# Altium project SCB.PrjPCB (part 3 of 6)

## Sheet CPU_Memory.SchDoc
size A3
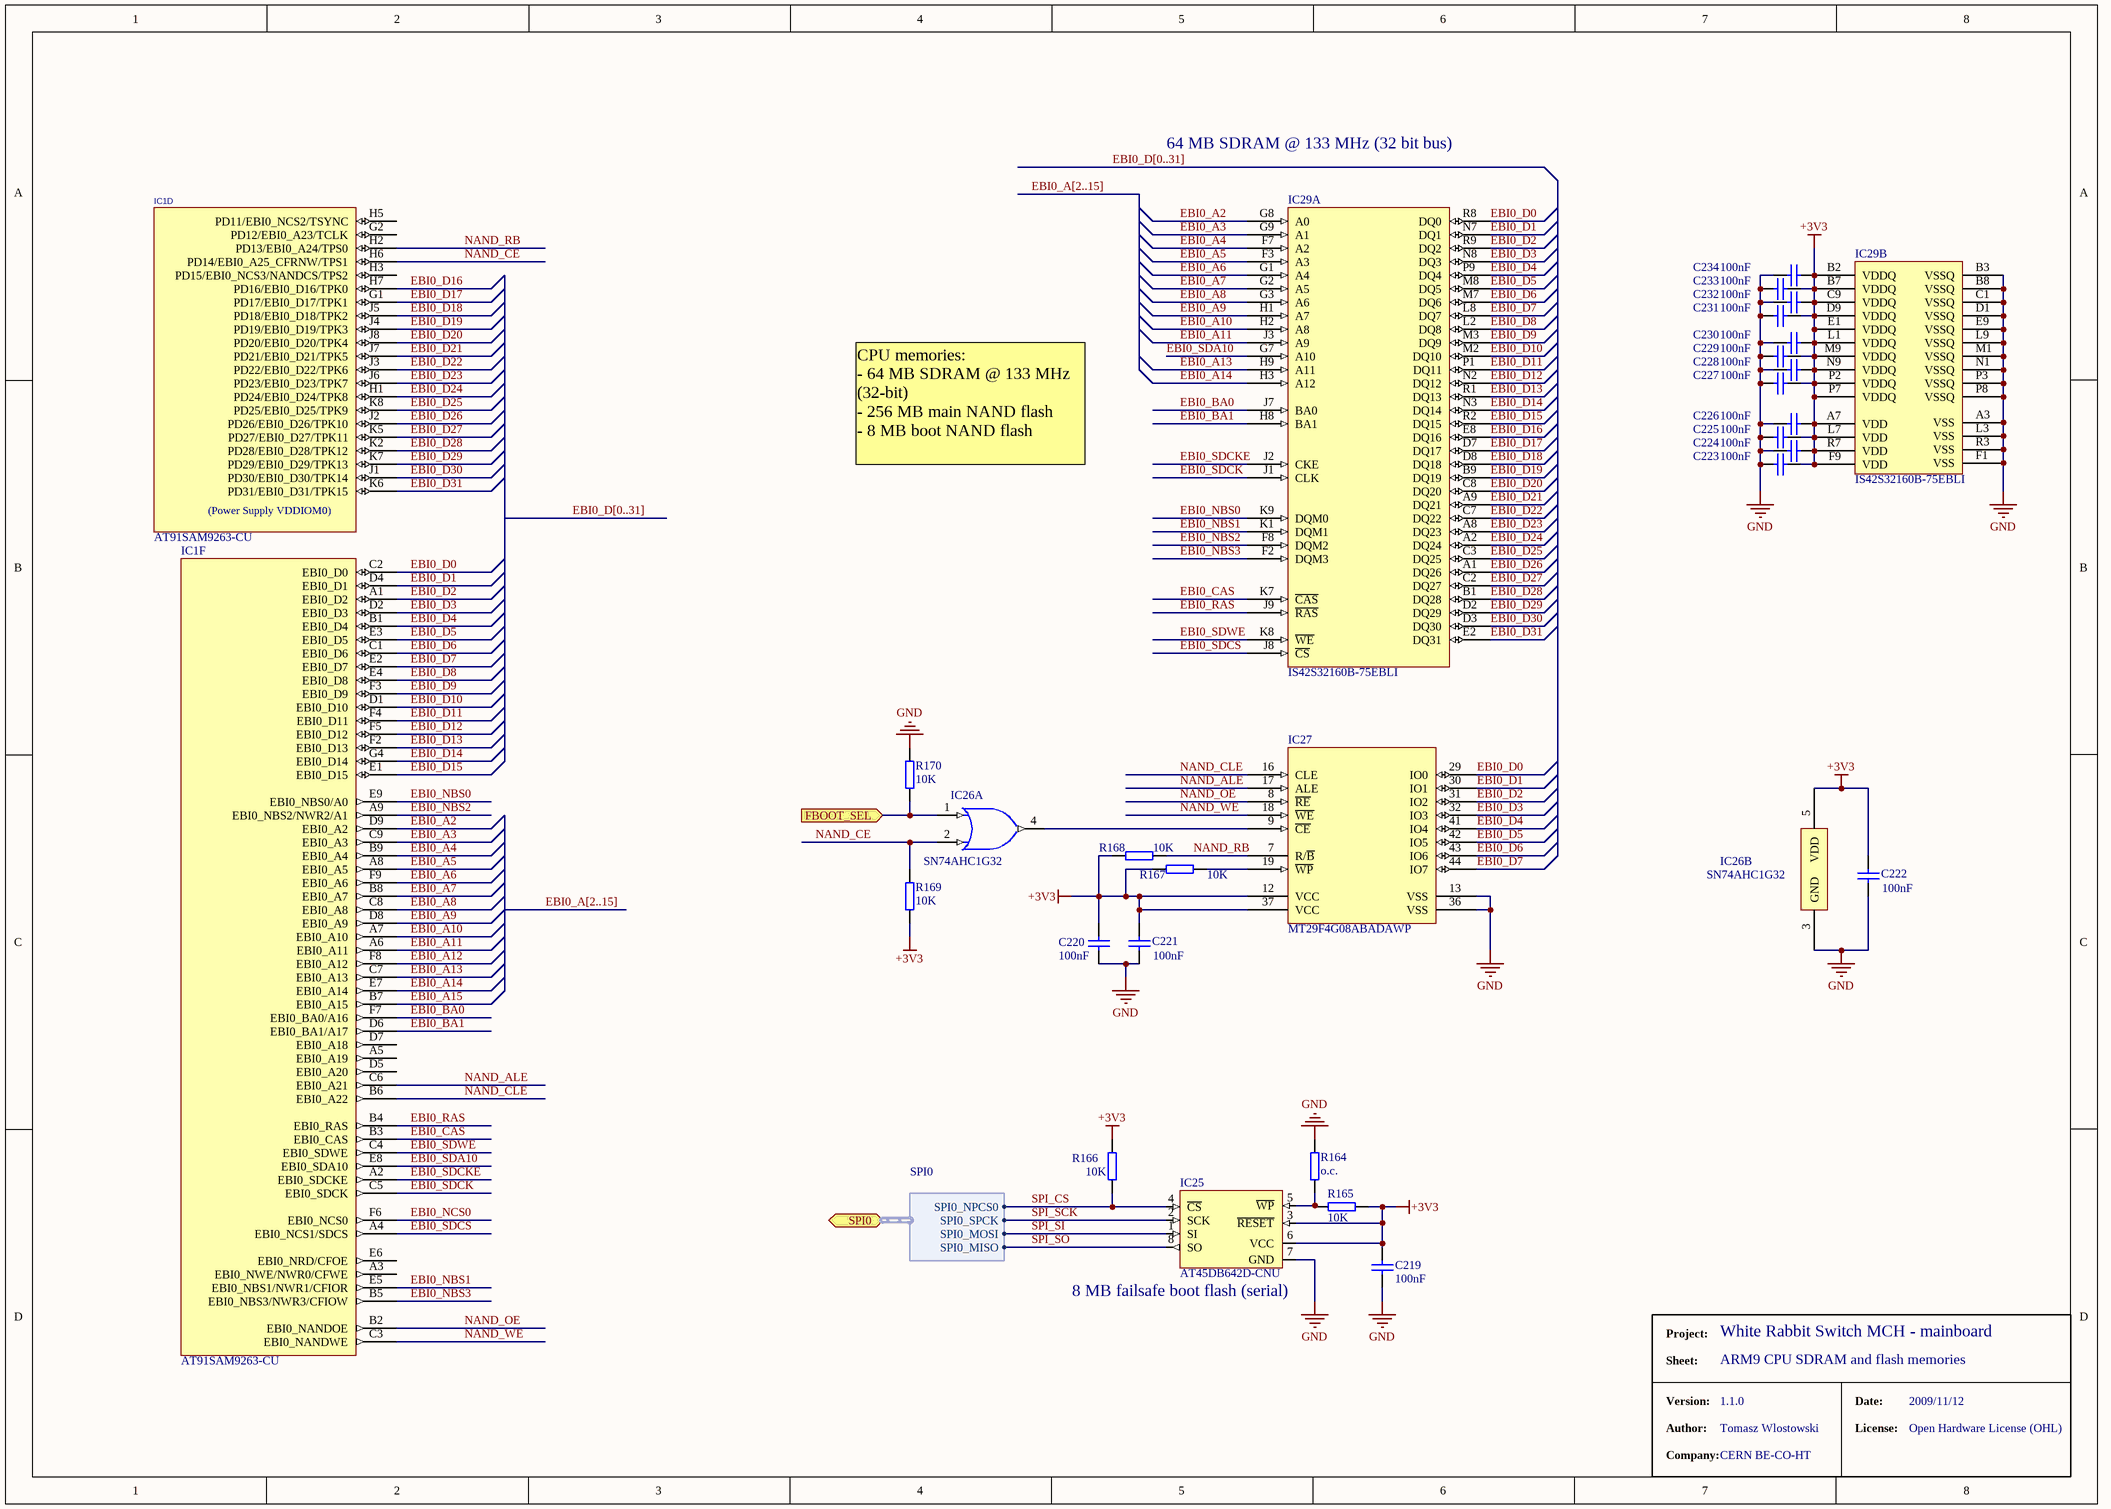
[diagram p8: CPU_Memory.SchDoc]

### Parts
(Parts that share a designator on the sheet are numbered #1, #2 ... from top to bottom, then left to right.)
C219  100nF  [CC1005-0402]
C220  100nF  [CC1005-0402]
C221  100nF  [CC1005-0402]
C222  100nF  [CC1005-0402]
C223  100nF  [CC1005-0402]
C224  100nF  [CC1005-0402]
C225  100nF  [CC1005-0402]
C226  100nF  [CC1005-0402]
C227  100nF  [CC1005-0402]
C228  100nF  [CC1005-0402]
C229  100nF  [CC1005-0402]
C230  100nF  [CC1005-0402]
C231  100nF  [CC1005-0402]
C232  100nF  [CC1005-0402]
C233  100nF  [CC1005-0402]
C234  100nF  [CC1005-0402]
IC1#1  AT91SAM9263-CU  [TFBGA324]  (part D of 12)
IC1#2  AT91SAM9263-CU  [TFBGA324]  (part F of 9)
IC25  AT45DB642D-CNU  [8CN3]
IC26  SN74AHC1G32  [SOT23-5AL]  (parts A,B of 2)
IC27  MT29F4G08ABADAWP  [TSOP48_12x20]
IC29  IS42S32160B-75EBLI  [BGA90C80P9X15_1300X1100X120]  (parts A,B of 2)
R164  o.c.  [0402]
R165  10K  [0402]
R166  10K  [0402]
R167  10K  [0402]
R168  10K  [0402]
R169  10K  [0402]
R170  10K  [0402]

### Ports
FBOOT_SEL (in), SPI0 (harness SPI0)

### Harnesses
SPI0: SPI0_MISO, SPI0_MOSI, SPI0_SPCK, SPI0_NPCS0

### Nets
+3V3: C219.1 C220.2 C221.2 C222.2 C223.1 C224.1 C225.1 C226.1 C227.1 C228.1 C229.1 C230.1 C231.1 C232.1 C233.1 C234.1 IC25.3(~{RESET}) IC25.6(VCC) IC26.5(VDD) IC27.12(VCC) IC27.37(VCC) IC29.A7(VDD) IC29.B2(VDDQ) IC29.B7(VDDQ) IC29.C9(VDDQ) IC29.D9(VDDQ) IC29.E1(VDDQ) IC29.F9(VDD) IC29.L1(VDDQ) IC29.L7(VDD) IC29.M9(VDDQ) IC29.N9(VDDQ) IC29.P2(VDDQ) IC29.P7(VDDQ) IC29.R7(VDD) R165.2 R166.2 R167.2 R168.2 R169.2
GND: C219.2 C220.1 C221.1 C222.1 C223.2 C224.2 C225.2 C226.2 C227.2 C228.2 C229.2 C230.2 C231.2 C232.2 C233.2 C234.2 IC25.7(GND) IC26.3(GND) IC27.13(VSS) IC27.36(VSS) IC29.A3(VSS) IC29.B3(VSSQ) IC29.B8(VSSQ) IC29.C1(VSSQ) IC29.D1(VSSQ) IC29.E9(VSSQ) IC29.F1(VSS) IC29.L3(VSS) IC29.L9(VSSQ) IC29.M1(VSSQ) IC29.N1(VSSQ) IC29.P3(VSSQ) IC29.P8(VSSQ) IC29.R3(VSS) R164.1 R170.2
EBI0_A2: IC1#2.D9(EBI0_A2) IC29.G8(A0)
EBI0_A3: IC1#2.C9(EBI0_A3) IC29.G9(A1)
EBI0_A4: IC1#2.B9(EBI0_A4) IC29.F7(A2)
EBI0_A5: IC1#2.A8(EBI0_A5) IC29.F3(A3)
EBI0_A6: IC1#2.F9(EBI0_A6) IC29.G1(A4)
EBI0_A7: IC1#2.B8(EBI0_A7) IC29.G2(A5)
EBI0_A8: IC1#2.C8(EBI0_A8) IC29.G3(A6)
EBI0_A9: IC1#2.D8(EBI0_A9) IC29.H1(A7)
EBI0_A10: IC1#2.A7(EBI0_A10) IC29.H2(A8)
EBI0_A11: IC1#2.A6(EBI0_A11) IC29.J3(A9)
EBI0_A12: IC1#2.F8(EBI0_A12)
EBI0_A13: IC1#2.C7(EBI0_A13) IC29.H9(A11)
EBI0_A14: IC1#2.E7(EBI0_A14) IC29.H3(A12)
EBI0_A15: IC1#2.B7(EBI0_A15)
EBI0_BA0: IC1#2.F7(EBI0_BA0/A16) IC29.J7(BA0)
EBI0_BA1: IC1#2.D6(EBI0_BA1/A17) IC29.H8(BA1)
EBI0_CAS: IC1#2.B3(EBI0_CAS) IC29.K7(~{CAS})
EBI0_D0: IC1#2.C2(EBI0_D0) IC27.29(IO0) IC29.R8(DQ0)
EBI0_D1: IC1#2.D4(EBI0_D1) IC27.30(IO1) IC29.N7(DQ1)
EBI0_D2: IC1#2.A1(EBI0_D2) IC27.31(IO2) IC29.R9(DQ2)
EBI0_D3: IC1#2.D2(EBI0_D3) IC27.32(IO3) IC29.N8(DQ3)
EBI0_D4: IC1#2.B1(EBI0_D4) IC27.41(IO4) IC29.P9(DQ4)
EBI0_D5: IC1#2.E3(EBI0_D5) IC27.42(IO5) IC29.M8(DQ5)
EBI0_D6: IC1#2.C1(EBI0_D6) IC27.43(IO6) IC29.M7(DQ6)
EBI0_D7: IC1#2.E2(EBI0_D7) IC27.44(IO7) IC29.L8(DQ7)
EBI0_D8: IC1#2.E4(EBI0_D8) IC29.L2(DQ8)
EBI0_D9: IC1#2.F3(EBI0_D9) IC29.M3(DQ9)
EBI0_D10: IC1#2.D1(EBI0_D10) IC29.M2(DQ10)
EBI0_D11: IC1#2.F4(EBI0_D11) IC29.P1(DQ11)
EBI0_D12: IC1#2.F5(EBI0_D12) IC29.N2(DQ12)
EBI0_D13: IC1#2.F2(EBI0_D13) IC29.R1(DQ13)
EBI0_D14: IC1#2.G4(EBI0_D14) IC29.N3(DQ14)
EBI0_D15: IC1#2.E1(EBI0_D15) IC29.R2(DQ15)
EBI0_D16: IC1#1.H7(PD16/EBI0_D16/TPK0) IC29.E8(DQ16)
EBI0_D17: IC1#1.G1(PD17/EBI0_D17/TPK1) IC29.D7(DQ17)
EBI0_D18: IC1#1.J5(PD18/EBI0_D18/TPK2) IC29.D8(DQ18)
EBI0_D19: IC1#1.J4(PD19/EBI0_D19/TPK3) IC29.B9(DQ19)
EBI0_D20: IC1#1.J8(PD20/EBI0_D20/TPK4) IC29.C8(DQ20)
EBI0_D21: IC1#1.J7(PD21/EBI0_D21/TPK5) IC29.A9(DQ21)
EBI0_D22: IC1#1.J3(PD22/EBI0_D22/TPK6) IC29.C7(DQ22)
EBI0_D23: IC1#1.J6(PD23/EBI0_D23/TPK7) IC29.A8(DQ23)
EBI0_D24: IC1#1.H1(PD24/EBI0_D24/TPK8) IC29.A2(DQ24)
EBI0_D25: IC1#1.K8(PD25/EBI0_D25/TPK9) IC29.C3(DQ25)
EBI0_D26: IC1#1.J2(PD26/EBI0_D26/TPK10) IC29.A1(DQ26)
EBI0_D27: IC1#1.K5(PD27/EBI0_D27/TPK11) IC29.C2(DQ27)
EBI0_D28: IC1#1.K2(PD28/EBI0_D28/TPK12) IC29.B1(DQ28)
EBI0_D29: IC1#1.K7(PD29/EBI0_D29/TPK13) IC29.D2(DQ29)
EBI0_D30: IC1#1.J1(PD30/EBI0_D30/TPK14) IC29.D3(DQ30)
EBI0_D31: IC1#1.K6(PD31/EBI0_D31/TPK15) IC29.E2(DQ31)
EBI0_NBS0: IC1#2.E9(EBI0_NBS0/A0) IC29.K9(DQM0)
EBI0_NBS1: IC1#2.E5(EBI0_NBS1/NWR1/CFIOR) IC29.K1(DQM1)
EBI0_NBS2: IC1#2.A9(EBI0_NBS2/NWR2/A1) IC29.F8(DQM2)
EBI0_NBS3: IC1#2.B5(EBI0_NBS3/NWR3/CFIOW) IC29.F2(DQM3)
EBI0_NCS0: IC1#2.F6(EBI0_NCS0)
EBI0_RAS: IC1#2.B4(EBI0_RAS) IC29.J9(~{RAS})
EBI0_SDA10: IC1#2.E8(EBI0_SDA10) IC29.G7(A10)
EBI0_SDCK: IC1#2.C5(EBI0_SDCK) IC29.J1(CLK)
EBI0_SDCKE: IC1#2.A2(EBI0_SDCKE) IC29.J2(CKE)
EBI0_SDCS: IC1#2.A4(EBI0_NCS1/SDCS) IC29.J8(~{CS})
EBI0_SDWE: IC1#2.C4(EBI0_SDWE) IC29.K8(~{WE})
NAND_ALE: IC1#2.C6(EBI0_A21) IC27.17(ALE)
NAND_CE: IC1#1.H6(PD14/EBI0_A25_CFRNW/TPS1) IC26.2(B) R169.1
NAND_CLE: IC1#2.B6(EBI0_A22) IC27.16(CLE)
NAND_OE: IC1#2.B2(EBI0_NANDOE) IC27.8(~{RE})
NAND_RB: IC1#1.H2(PD13/EBI0_A24/TPS0) IC27.7(R/~{B}) R168.1
NAND_WE: IC1#2.C3(EBI0_NANDWE) IC27.18(~{WE})
SPI_CS: IC25.4(~{CS}) R166.1 ; port SPI0.SPI0_NPCS0  [project net SPI0.SPI0_NPCS0]
SPI_SCK: IC25.2(SCK) ; port SPI0.SPI0_SPCK  [project net SPI0.SPI0_SPCK]
SPI_SI: IC25.1(SI) ; port SPI0.SPI0_MOSI  [project net SPI0.SPI0_MOSI]
SPI_SO: IC25.8(SO) ; port SPI0.SPI0_MISO  [project net SPI0.SPI0_MISO]
NetIC25_5: IC25.5(~{WP}) R164.2 R165.1
NetIC26_1: IC26.1(A) R170.1 ; port FBOOT_SEL
NetIC26_4: IC26.4(Y) IC27.9(~{CE})
NetIC27_19: IC27.19(~{WP}) R167.1

Not connected (* = marked no-connect by the designer): IC1#1 G2(PD12/EBI0_A23/TCLK) H3(PD15/EBI0_NCS3/NANDCS/TPS2) H5(PD11/EBI0_NCS2/TSYNC); IC1#2 A3(EBI0_NWE/NWR0/CFWE) A5(EBI0_A19) D5(EBI0_A20) D7(EBI0_A18) E6(EBI0_NRD/CFOE)

### Buses and harness runs
bus EBI0_A[2..15]
bus EBI0_D[0..31]

### Notes on the sheet
- 64 MB SDRAM @ 133 MHz (32 bit bus)
- CPU memories:
  - 64 MB SDRAM @ 133 MHz (32-bit)
  - 256 MB main NAND flash
  - 8 MB boot NAND flash
- 8 MB failsafe boot flash (serial)
- Project:
- Sheet:
- ARM9 CPU SDRAM and flash memories
- White Rabbit Switch MCH - mainboard
- Version:
- Author:
- Company:
- 1.1.0
- Tomasz Wlostowski
- CERN BE-CO-HT
- Date:
- License:
- 2009/11/12
- Open Hardware License (OHL)
- (in symbol AT91SAM9263, part D) (Power Supply VDDIOM0)

### Library data of the parts
C219-C234 = CC0402_100NF_16V_10%_X7R: as C100 on sheet FPGA_GTX; Published: 8-Jun-2000; LatestRevisionDate: 17-Jul-2002; LatestRevisionNote: Re-released for DXP Platform.; PackageReference: RAD-0.3; Publisher: Altium Limited; Distributor1: Digikey; Distributor1 PN: 445-4952-1-ND; Case: 0402; Value: 100nF
IC1#1 IC1#2 = AT91SAM9263: Atmel ARM926 MCU; Supplier: EBV; RefId: AT91SAM9263-CU; Value: AT91SAM9263-CU
IC25 = AT45DB642D: 64-megabit 2.7V, Dual-Interface DataFlash; Value: AT45DB642D-CNU; Distributor1 PN: AT45DB642D-CNU-ND; Case: CASON; Distributor1: Digikey
IC26 = SN74AHC1G32: TI single OR gate; RefId: 296-1093-1-ND; Value: SN74AHC1G32DBVR; Supplier: Digikey
IC27 = MT29F4G08ABADAWP: NAND Flash 512Mx8, 3.3V Asynch/Page; Value: MT29F4G08ABADAWP; Distributor1 PN: 557-1458-1-ND; Distributor1: Digikey
IC29 = IS42S32160B-BGA: SDRAM 512MBit (16Mx32) 133MHz BGA-90
R164 = R0402_O.C.: SMD Resistor; Case: 0402; Manufacturer1: N/A; Manufacturer1 PN: N/A; Distributor1: N/A; Distributor1 PN: N/A; TCR: N/A; Power Rating: N/A; Tolerance: N/A; Value: o.c.
R165-R170 = R0402_10K_±1%_0.1W_100PPM: SMD Resistor; Manufacturer1: Panasonic; Manufacturer1 PN: ERJ-2RKF1002X; TCR: 100ppm; Power Rating: 0.1W; Tolerance: ±1%; Case: 0402; Distributor1: DigiKey; Distributor1 PN: P10.0KLCT-ND; Value: 10K

## Sheet SMI_Link_7-12.SchDoc
size A4
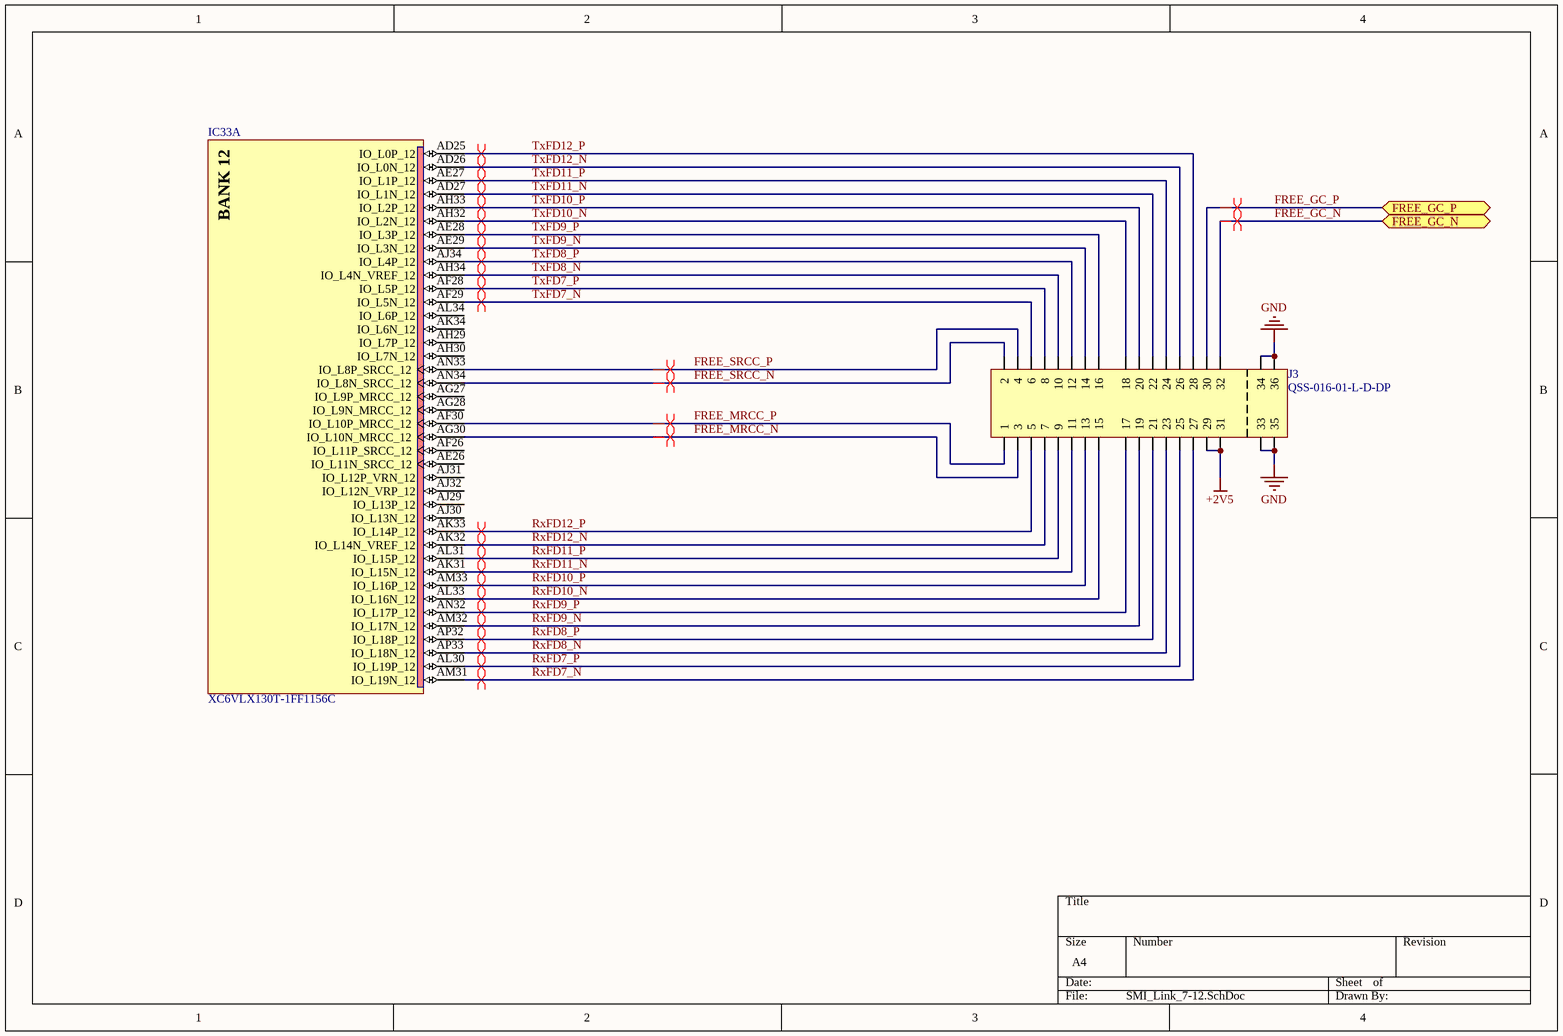
[diagram p9: SMI_Link_7-12.SchDoc]

### Parts
IC33  XC6VLX130T-1FF1156C  [FF1156]  (part A of 20)
J3  QSS-016-01-L-D-DP  [QSS-016-01-X-D-DP-A]

### Ports
FREE_GC_N (bidir), FREE_GC_P (bidir)

### Nets
+2V5: J3.29 J3.31
GND: J3.33 J3.34 J3.35 J3.36
FREE_GC_N: J3.32 ; port FREE_GC_N  [project net FREE_GC1_P]
FREE_GC_P: J3.30 ; port FREE_GC_P  [project net FREE_GC1_N]
FREE_MRCC_N: IC33.AG30(IO_L10N_MRCC_12) J3.3
FREE_MRCC_P: IC33.AF30(IO_L10P_MRCC_12) J3.1
FREE_SRCC_N: IC33.AN34(IO_L8N_SRCC_12) J3.2
FREE_SRCC_P: IC33.AN33(IO_L8P_SRCC_12) J3.4
RxFD7_N: IC33.AM31(IO_L19N_12) J3.27
RxFD7_P: IC33.AL30(IO_L19P_12) J3.25
RxFD8_N: IC33.AP33(IO_L18N_12) J3.23
RxFD8_P: IC33.AP32(IO_L18P_12) J3.21
RxFD9_N: IC33.AM32(IO_L17N_12) J3.19
RxFD9_P: IC33.AN32(IO_L17P_12) J3.17
RxFD10_N: IC33.AL33(IO_L16N_12) J3.15
RxFD10_P: IC33.AM33(IO_L16P_12) J3.13
RxFD11_N: IC33.AK31(IO_L15N_12) J3.11
RxFD11_P: IC33.AL31(IO_L15P_12) J3.9
RxFD12_N: IC33.AK32(IO_L14N_VREF_12) J3.7
RxFD12_P: IC33.AK33(IO_L14P_12) J3.5
TxFD7_N: IC33.AF29(IO_L5N_12) J3.6
TxFD7_P: IC33.AF28(IO_L5P_12) J3.8
TxFD8_N: IC33.AH34(IO_L4N_VREF_12) J3.10
TxFD8_P: IC33.AJ34(IO_L4P_12) J3.12
TxFD9_N: IC33.AE29(IO_L3N_12) J3.14
TxFD9_P: IC33.AE28(IO_L3P_12) J3.16
TxFD10_N: IC33.AH32(IO_L2N_12) J3.18
TxFD10_P: IC33.AH33(IO_L2P_12) J3.20
TxFD11_N: IC33.AD27(IO_L1N_12) J3.22
TxFD11_P: IC33.AE27(IO_L1P_12) J3.24
TxFD12_N: IC33.AD26(IO_L0N_12) J3.26
TxFD12_P: IC33.AD25(IO_L0P_12) J3.28

Not connected (* = marked no-connect by the designer): IC33 AE26(IO_L11N_SRCC_12) AF26(IO_L11P_SRCC_12) AG27(IO_L9P_MRCC_12) AG28(IO_L9N_MRCC_12) AH29(IO_L7P_12) AH30(IO_L7N_12) AJ29(IO_L13P_12) AJ30(IO_L13N_12) AJ31(IO_L12P_VRN_12) AJ32(IO_L12N_VRP_12) AK34(IO_L6N_12) AL34(IO_L6P_12)

### Layout directives
differential pair: FREE_GC1_N, FREE_GC1_P, FREE_MRCC_N, FREE_MRCC_P, FREE_SRCC_N, FREE_SRCC_P, RxFD7_N, RxFD7_P, RxFD8_N, RxFD8_P, RxFD9_N, RxFD9_P, RxFD10_N, RxFD10_P, RxFD11_N, RxFD11_P, RxFD12_N, RxFD12_P, TxFD7_N, TxFD7_P, TxFD8_N, TxFD8_P, TxFD9_N, TxFD9_P, TxFD10_N, TxFD10_P, TxFD11_N, TxFD11_P, TxFD12_N, TxFD12_P

### Notes on the sheet
- (in symbol XC6VLX130T-1FF1156C, part A) BANK 12

### Library data of the parts
IC33 = XC6VLX130T-1FF1156C: Virtex-6 LXT Platform FPGA, 600 User I/Os, 20 GTXs, 1156-Ball FFBGA, Speed Grade 1, Commercial Grade; FirstPublished: 17-Nov-2009; DatasheetVersion: v2.0, Sep-2009; PackageVersion: ver1.0, Jun-2009; PackageReference: FF1156; Publisher: Altium Limited; PackageDescription: 1156-Ball Flip-Chip Fine Pitch Ball Grid Array (FF1156); Code_JEDEC: MS-034-AAR-1; Code_IPC: BGA100P34X34-1156; ComponentLink1Description: Virtex-6 Datasheet; ComponentLink1URL: http://www.xilinx.com/support/documentation/data_sheets/ds150.pdf; ComponentLink2Description: Pinout Specification; ComponentLink2URL: http://www.xilinx.com/support/packagefiles/virtex-6-pkgs.htm; ComponentLink3Description: FF1156 Package Drawing; ComponentLink3URL: http://www.xilinx.com/support/documentation/package_specs/ff1156.pdf; ComponentLink4Description: Virtex-6 Documents; ComponentLink4URL: http://www.xilinx.com/support/documentation/virtex-6.htm; ComponentLink5Description: Xilinx.com Home; ComponentLink5URL: http://www.xilinx.com

## Sheet uTCA_Tongue3.SchDoc
size A4 portrait
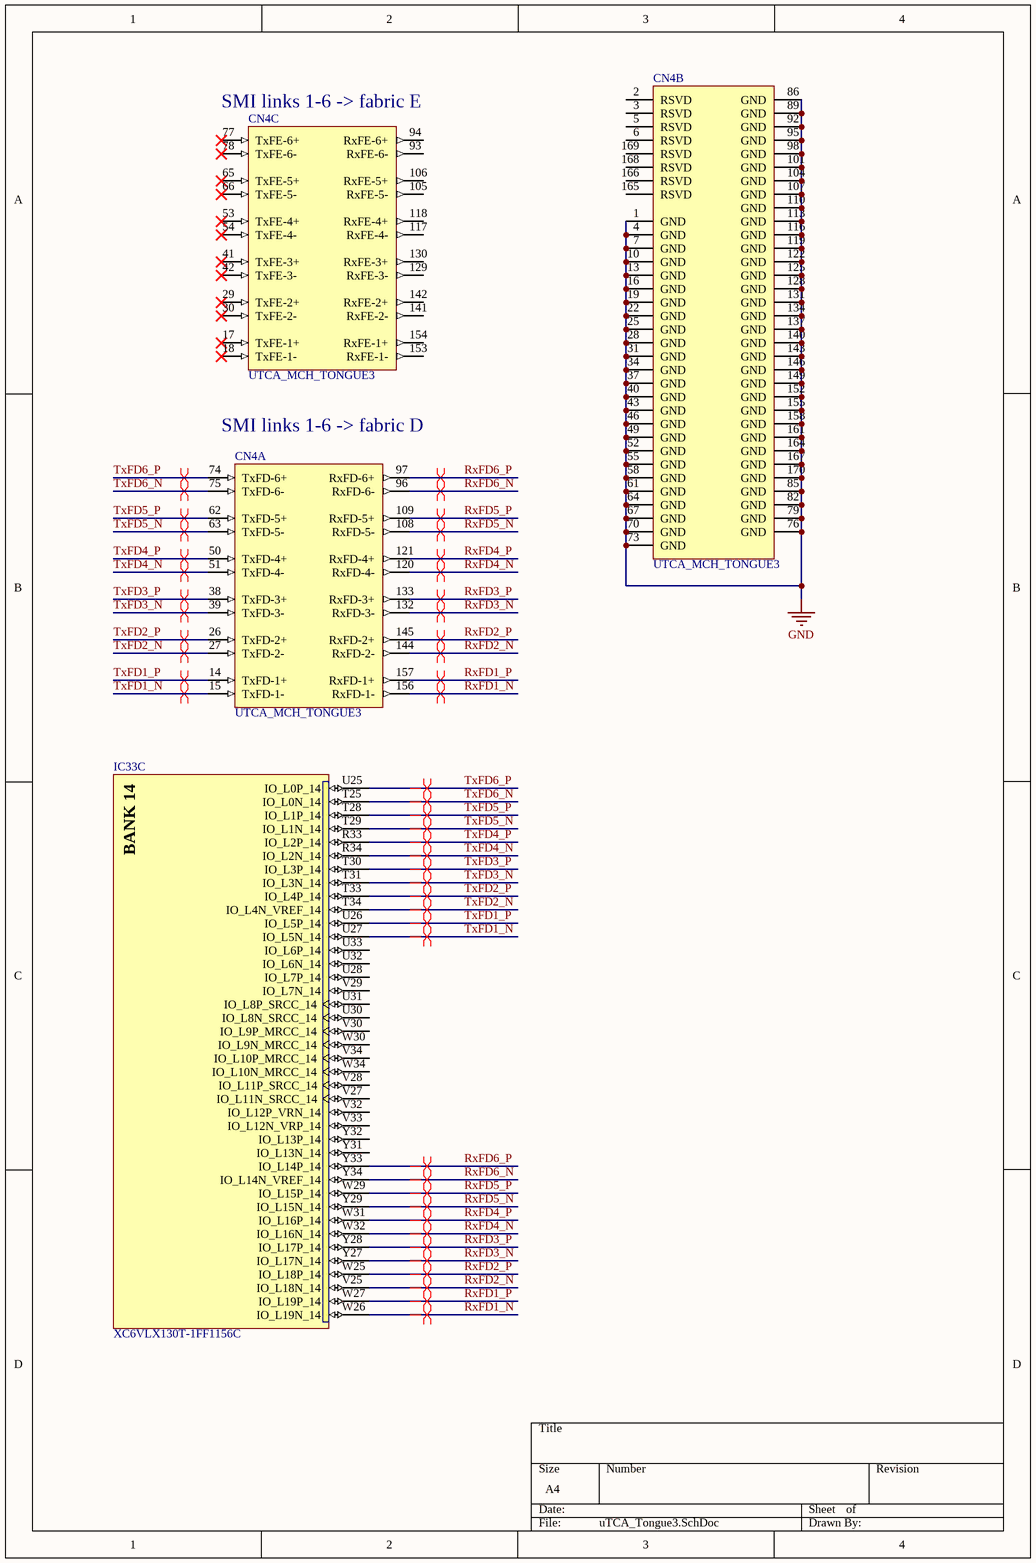
[diagram p10: uTCA_Tongue3.SchDoc]

### Parts
CN4  UTCA_MCH_TONGUE3  [UTCA_MCH_TONGUE2_3_4]  (parts A,B,C of 7)
IC33  XC6VLX130T-1FF1156C  [FF1156]  (part C of 20)

### Nets
GND: CN4.1(GND) CN4.4(GND) CN4.7(GND) CN4.10(GND) CN4.13(GND) CN4.16(GND) CN4.19(GND) CN4.22(GND) CN4.25(GND) CN4.28(GND) CN4.31(GND) CN4.34(GND) CN4.37(GND) CN4.40(GND) CN4.43(GND) CN4.46(GND) CN4.49(GND) CN4.52(GND) CN4.55(GND) CN4.58(GND) CN4.61(GND) CN4.64(GND) CN4.67(GND) CN4.70(GND) CN4.73(GND) CN4.76(GND) CN4.79(GND) CN4.82(GND) CN4.85(GND) CN4.86(GND) CN4.89(GND) CN4.92(GND) CN4.95(GND) CN4.98(GND) CN4.101(GND) CN4.104(GND) CN4.107(GND) CN4.110(GND) CN4.113(GND) CN4.116(GND) CN4.119(GND) CN4.122(GND) CN4.125(GND) CN4.128(GND) CN4.131(GND) CN4.134(GND) CN4.137(GND) CN4.140(GND) CN4.143(GND) CN4.146(GND) CN4.149(GND) CN4.152(GND) CN4.155(GND) CN4.158(GND) CN4.161(GND) CN4.164(GND) CN4.167(GND) CN4.170(GND)
RxFD1_N: CN4.156(RxFD-1-) IC33.W26(IO_L19N_14)
RxFD1_P: CN4.157(RxFD-1+) IC33.W27(IO_L19P_14)
RxFD2_N: CN4.144(RxFD-2-) IC33.V25(IO_L18N_14)
RxFD2_P: CN4.145(RxFD-2+) IC33.W25(IO_L18P_14)
RxFD3_N: CN4.132(RxFD-3-) IC33.Y27(IO_L17N_14)
RxFD3_P: CN4.133(RxFD-3+) IC33.Y28(IO_L17P_14)
RxFD4_N: CN4.120(RxFD-4-) IC33.W32(IO_L16N_14)
RxFD4_P: CN4.121(RxFD-4+) IC33.W31(IO_L16P_14)
RxFD5_N: CN4.108(RxFD-5-) IC33.Y29(IO_L15N_14)
RxFD5_P: CN4.109(RxFD-5+) IC33.W29(IO_L15P_14)
RxFD6_N: CN4.96(RxFD-6-) IC33.Y34(IO_L14N_VREF_14)
RxFD6_P: CN4.97(RxFD-6+) IC33.Y33(IO_L14P_14)
TxFD1_N: CN4.15(TxFD-1-) IC33.U27(IO_L5N_14)
TxFD1_P: CN4.14(TxFD-1+) IC33.U26(IO_L5P_14)
TxFD2_N: CN4.27(TxFD-2-) IC33.T34(IO_L4N_VREF_14)
TxFD2_P: CN4.26(TxFD-2+) IC33.T33(IO_L4P_14)
TxFD3_N: CN4.39(TxFD-3-) IC33.T31(IO_L3N_14)
TxFD3_P: CN4.38(TxFD-3+) IC33.T30(IO_L3P_14)
TxFD4_N: CN4.51(TxFD-4-) IC33.R34(IO_L2N_14)
TxFD4_P: CN4.50(TxFD-4+) IC33.R33(IO_L2P_14)
TxFD5_N: CN4.63(TxFD-5-) IC33.T29(IO_L1N_14)
TxFD5_P: CN4.62(TxFD-5+) IC33.T28(IO_L1P_14)
TxFD6_N: CN4.75(TxFD-6-) IC33.T25(IO_L0N_14)
TxFD6_P: CN4.74(TxFD-6+) IC33.U25(IO_L0P_14)

Not connected (* = marked no-connect by the designer): CN4 2(RSVD) 3(RSVD) 5(RSVD) 6(RSVD) 17(TxFE-1+)* 18(TxFE-1-)* 29(TxFE-2+)* 30(TxFE-2-)* 41(TxFE-3+)* 42(TxFE-3-)* 53(TxFE-4+)* 54(TxFE-4-)* 65(TxFE-5+)* 66(TxFE-5-)* 77(TxFE-6+)* 78(TxFE-6-)* 93(RxFE-6-) 94(RxFE-6+) 105(RxFE-5-) 106(RxFE-5+) 117(RxFE-4-) 118(RxFE-4+) 129(RxFE-3-) 130(RxFE-3+) 141(RxFE-2-) 142(RxFE-2+) 153(RxFE-1-) 154(RxFE-1+) 165(RSVD) 166(RSVD) 168(RSVD) 169(RSVD); IC33 U28(IO_L7P_14) U30(IO_L8N_SRCC_14) U31(IO_L8P_SRCC_14) U32(IO_L6N_14) U33(IO_L6P_14) V27(IO_L11N_SRCC_14) V28(IO_L11P_SRCC_14) V29(IO_L7N_14) V30(IO_L9P_MRCC_14) V32(IO_L12P_VRN_14) V33(IO_L12N_VRP_14) V34(IO_L10P_MRCC_14) W30(IO_L9N_MRCC_14) W34(IO_L10N_MRCC_14) Y31(IO_L13N_14) Y32(IO_L13P_14)

### Layout directives
differential pair: RxFD1_N, RxFD1_P, RxFD2_N, RxFD2_P, RxFD3_N, RxFD3_P, RxFD4_N, RxFD4_P, RxFD5_N, RxFD5_P, RxFD6_N, RxFD6_P, TxFD1_N, TxFD1_P, TxFD2_N, TxFD2_P, TxFD3_N, TxFD3_P, TxFD4_N, TxFD4_P, TxFD5_N, TxFD5_P, TxFD6_N, TxFD6_P

### Notes on the sheet
- (near CN4) SMI links 1-6 -> fabric E
- (near CN4) SMI links 1-6 -> fabric D
- (in symbol XC6VLX130T-1FF1156C, part C) BANK 14

### Library data of the parts
CN4 = UTCA_MCH_TONGUE3: microTCA MTCA.0 standard MCH connector 3
IC33 = XC6VLX130T-1FF1156C: as IC33 on sheet SMI_Link_7-12; FirstPublished: 17-Nov-2009; DatasheetVersion: v2.0, Sep-2009; PackageVersion: ver1.0, Jun-2009; PackageReference: FF1156; Publisher: Altium Limited; PackageDescription: 1156-Ball Flip-Chip Fine Pitch Ball Grid Array (FF1156); Code_JEDEC: MS-034-AAR-1; Code_IPC: BGA100P34X34-1156; ComponentLink1Description: Virtex-6 Datasheet; ComponentLink1URL: http://www.xilinx.com/support/documentation/data_sheets/ds150.pdf; ComponentLink2Description: Pinout Specification; ComponentLink2URL: http://www.xilinx.com/support/packagefiles/virtex-6-pkgs.htm; ComponentLink3Description: FF1156 Package Drawing; ComponentLink3URL: http://www.xilinx.com/support/documentation/package_specs/ff1156.pdf; ComponentLink4Description: Virtex-6 Documents; ComponentLink4URL: http://www.xilinx.com/support/documentation/virtex-6.htm; ComponentLink5Description: Xilinx.com Home; ComponentLink5URL: http://www.xilinx.com

## Sheet External WatchDogs.SchDoc
size A4
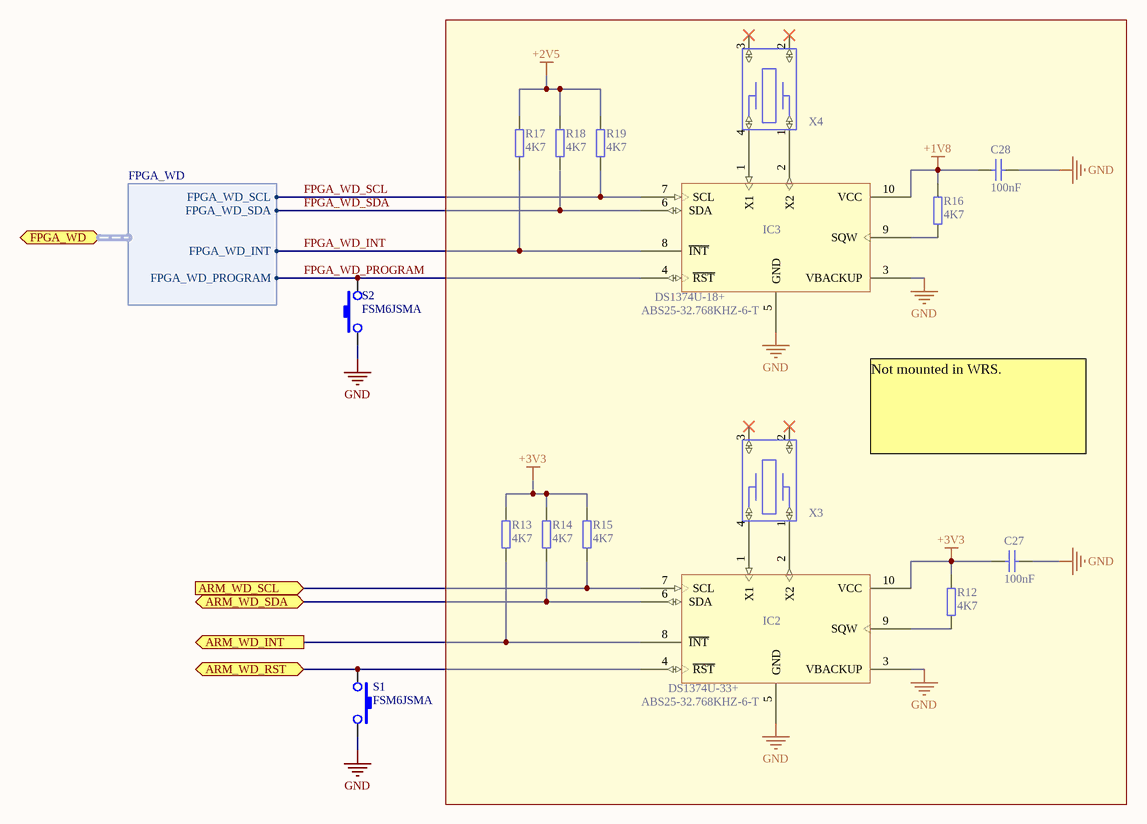
[diagram p11: External WatchDogs.SchDoc]

### Parts
C27  100nF  [CC1005-0402]
C28  100nF  [CC1005-0402]
IC2  DS1374U-33+  [UMAX10]
IC3  DS1374U-18+  [UMAX10]
R12  4K7  [0402]
R13  4K7  [0402]
R14  4K7  [0402]
R15  4K7  [0402]
R16  4K7  [0402]
R17  4K7  [0402]
R18  4K7  [0402]
R19  4K7  [0402]
S1  FSM6JSMA  [SWITCH]
S2  FSM6JSMA  [SWITCH]
X3  ABS25-32.768KHZ-6-T  [ABS25]
X4  ABS25-32.768KHZ-6-T  [ABS25]

### Ports
ARM_WD_INT (out), ARM_WD_RST (bidir), ARM_WD_SCL (in), ARM_WD_SDA (bidir), FPGA_WD (harness FPGA_WD)

### Harnesses
FPGA_WD: FPGA_WD_SCL, FPGA_WD_SDA, FPGA_WD_INT, FPGA_WD_PROGRAM

### Nets
+1V8: C28.2 IC3.10(VCC) R16.2
+2V5: R17.2 R18.2 R19.2
+3V3: C27.2 IC2.10(VCC) R12.2 R13.2 R14.2 R15.2
GND: C27.1 C28.1 IC2.3(VBACKUP) IC2.5(GND) IC3.3(VBACKUP) IC3.5(GND) S1.2 S2.1
ARM_WD_RST: IC2.4(~{RST}) S1.1 ; port ARM_WD_RST
FPGA_WD_INT: IC3.8(~{INT}) R17.1 ; port FPGA_WD.FPGA_WD_INT  [project net FPGA_WD.FPGA_WD_INT]
FPGA_WD_PROGRAM: IC3.4(~{RST}) S2.2 ; port FPGA_WD.FPGA_WD_PROGRAM  [project net FPGA_WD.FPGA_WD_PROGRAM]
FPGA_WD_SCL: IC3.7(SCL) R19.1 ; port FPGA_WD.FPGA_WD_SCL  [project net FPGA_WD.FPGA_WD_SCL]
FPGA_WD_SDA: IC3.6(SDA) R18.1 ; port FPGA_WD.FPGA_WD_SDA  [project net FPGA_WD.FPGA_WD_SDA]
NetIC1#1_H12: IC2.8(~{INT}) R13.1 ; port ARM_WD_INT
NetIC1#1_J15: IC2.7(SCL) R15.1 ; port ARM_WD_SCL
NetIC1#1_L14: IC2.6(SDA) R14.1 ; port ARM_WD_SDA
NetIC2_1: IC2.1(X1) X3.4(P4)
NetIC2_2: IC2.2(X2) X3.1(P1)
NetIC2_9: IC2.9(SQW) R12.1
NetIC3_1: IC3.1(X1) X4.4(P4)
NetIC3_2: IC3.2(X2) X4.1(P1)
NetIC3_9: IC3.9(SQW) R16.1

Not connected (* = marked no-connect by the designer): X3 2(P2)* 3(P3)*; X4 2(P2)* 3(P3)*

### Notes on the sheet
- Not mounted in WRS.

### Library data of the parts
C27 C28 = CC0402_100NF_16V_10%_X7R: as C100 on sheet FPGA_GTX; Published: 8-Jun-2000; LatestRevisionDate: 17-Jul-2002; LatestRevisionNote: Re-released for DXP Platform.; PackageReference: RAD-0.3; Publisher: Altium Limited; Distributor1: Digikey; Distributor1 PN: 445-4952-1-ND; Case: 0402; Value: 100nF
IC2 = DS1374U-33+: I2C, 32 BIT BINARY COUNTER WATCHDOG RTC; Value: DS1374U-33+; Distributor1 PN: DS1374U-33+-ND; Distributor1: Digikey
IC3 = DS1374U-18+: I2C, 32 BIT BINARY COUNTER WATCHDOG RTC; Value: DS1374U-18+; Distributor1 PN: DS1374U-18+-ND; Distributor1: Digikey
R12-R19 = R0402_4.7K_±1%_0.1W_100PPM: SMD Resistor; Manufacturer1: Panasonic; Manufacturer1 PN: ERJ-2RKF4701X; TCR: 100ppm; Power Rating: 0.1W; Tolerance: ±1%; Case: 0402; Distributor1: DigiKey; Distributor1 PN: ERJ-2RKF4701X; Value: 4K7
S1 S2 = SW-PB: Push button; Manufacturer: Tyco Electronics; Value: FSM6JSMA; Distributor1 PN: 1555991; Distributor1: Farnell
X3 X4 = ECSXTAL: Crystal 32.768 Hz 6,0pF SMD; MANF: Abracon Corporation; LEVEL: STD; PKG_TYPE: SOJ-4; MANF_PN: ABS25-32.768KHZ-6-T; VALUE: ABS25-32.768KHZ-6-T; Distributor1: 535-10240-1-ND

## Sheet FPGA_Configuration.SchDoc
size A3
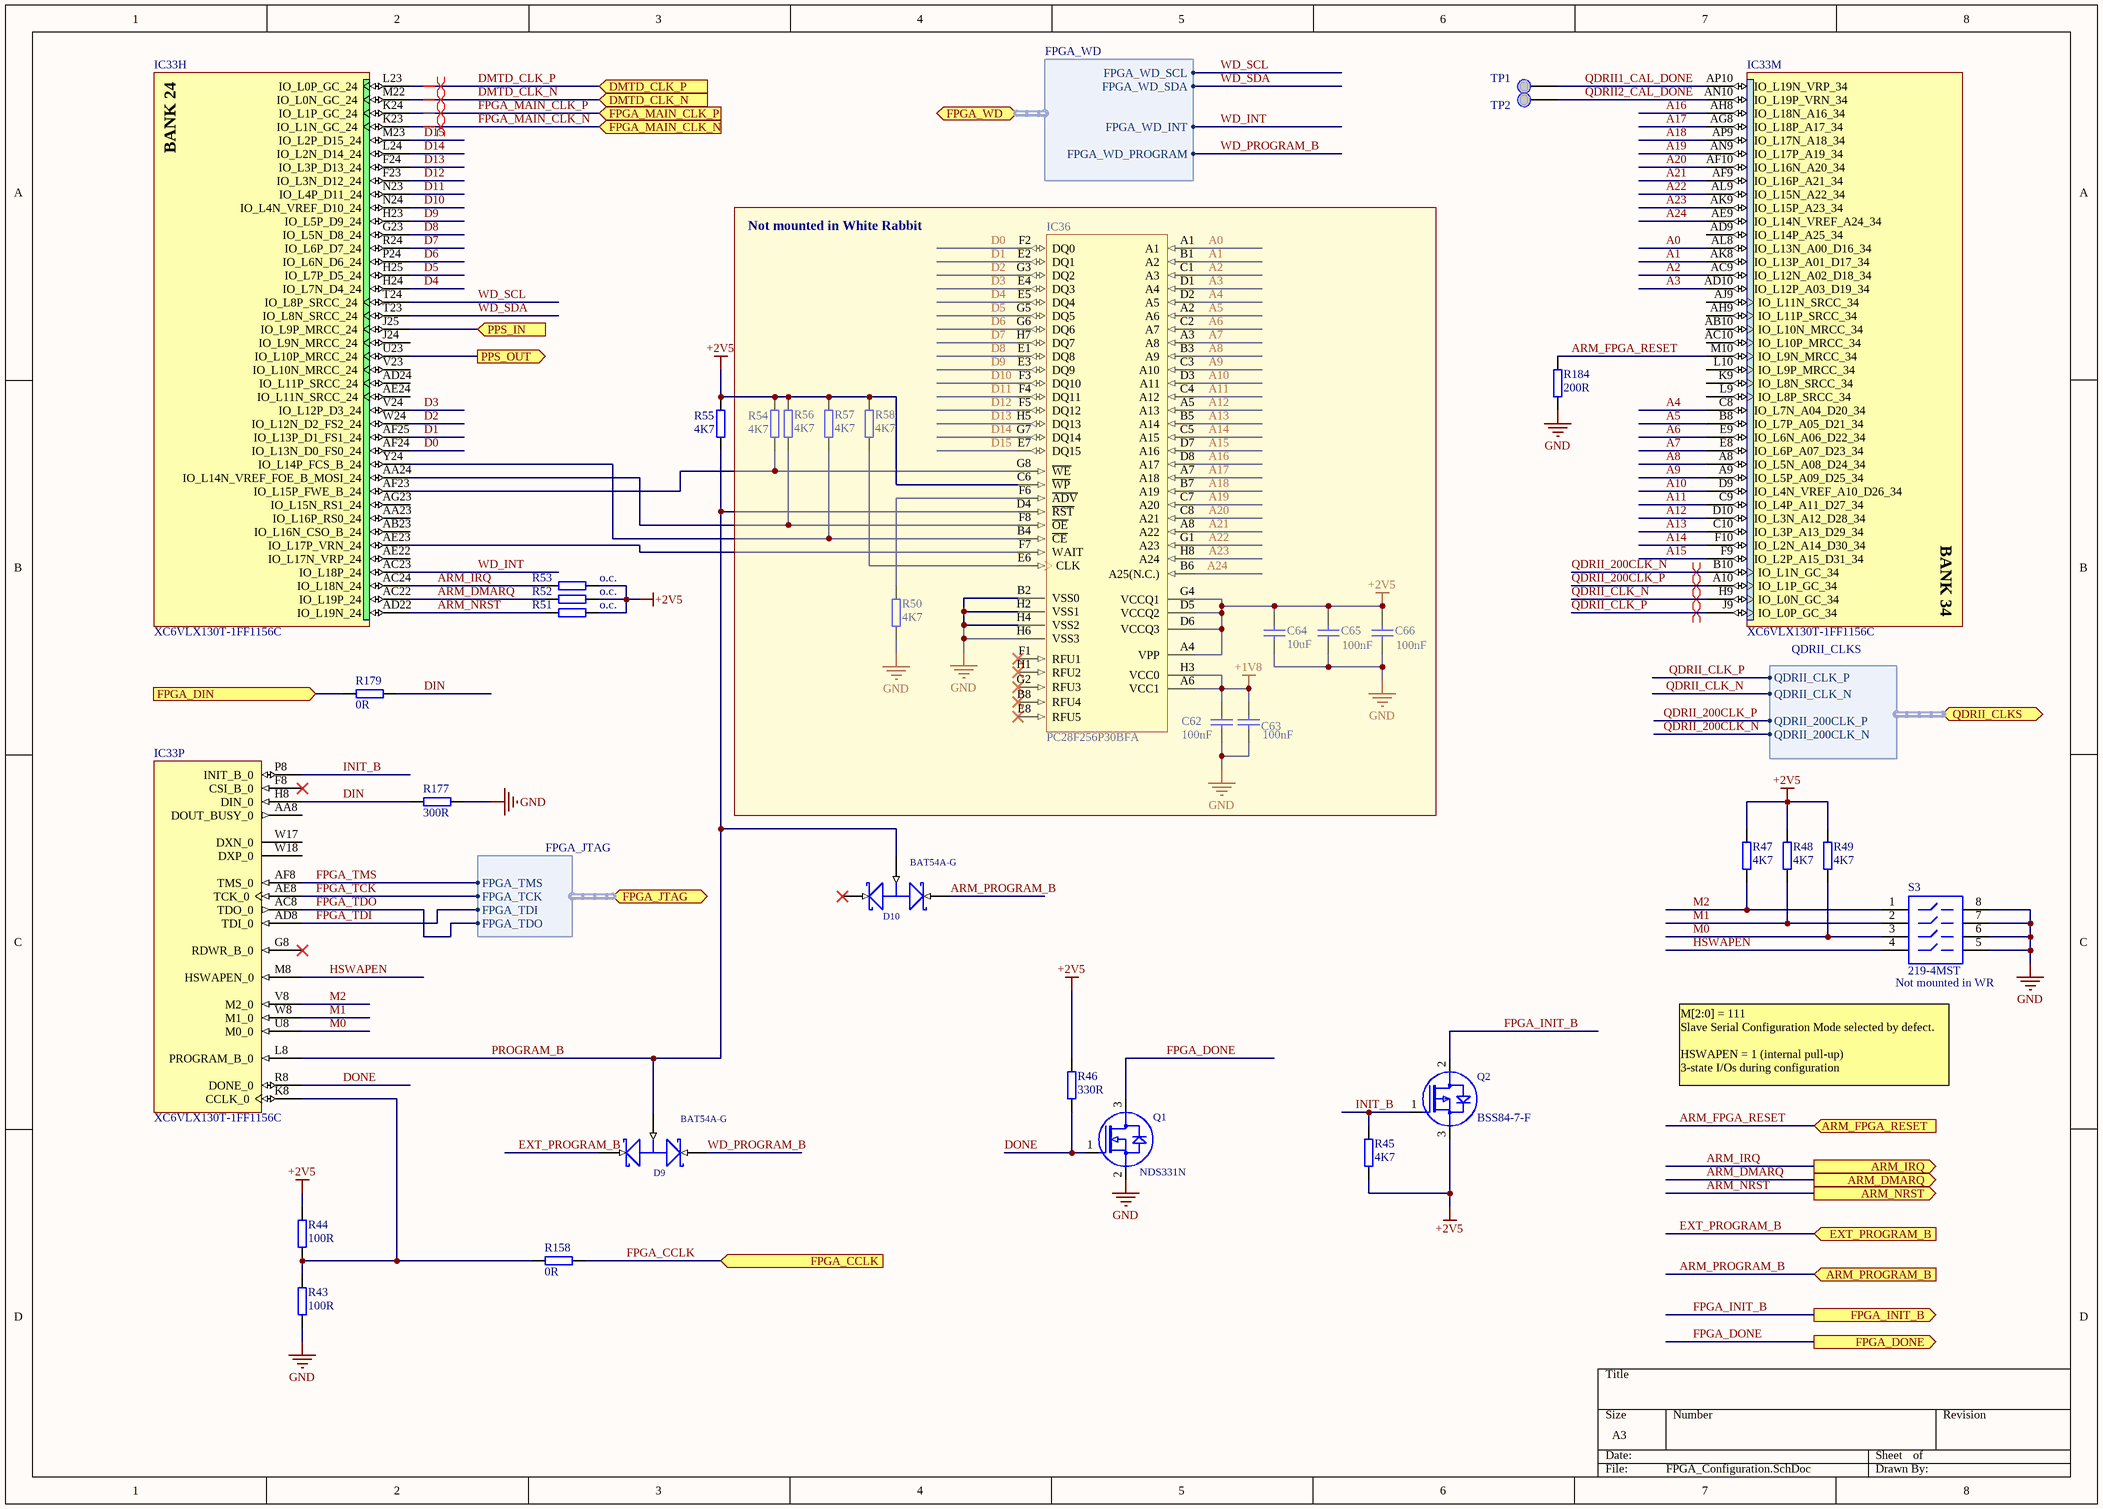
[diagram p12: FPGA_Configuration.SchDoc]

### Parts
C62  100nF  [CC1005-0402]
C63  100nF  [CC1005-0402]
C64  10uF  [CC1608-0603]
C65  100nF  [CC1005-0402]
C66  100nF  [CC1005-0402]
D9  BAT54A-G  [SOT23]
D10  BAT54A-G  [SOT23]
IC33  XC6VLX130T-1FF1156C  [FF1156]  (parts H,M,P of 20)
IC36  PC28F256P30BFA  [BGA64C100P8X8_1300X1000X120]
Q1  NDS331N  [SOT23-3]
Q2  FET-3PIN  [SOT-23]  (value not drawn)
R43  100R  [0402]
R44  100R  [0402]
R45  4K7  [0402]
R46  330R  [0402]
R47  4K7  [0402]
R48  4K7  [0402]
R49  4K7  [0402]
R50  4K7  [0402]
R51  o.c.  [0402]
R52  o.c.  [0402]
R53  o.c.  [0402]
R54  4K7  [0402]
R55  4K7  [0402]
R56  4K7  [0402]
R57  4K7  [0402]
R58  4K7  [0402]
R158  value 0R  [0402]  (hidden comment: Jumper)
R177  300R  [0402]
R179  value 0R  [0402]  (hidden comment: Jumper)
R184  200R  [0402]
S3  219-4MST  Mounted: Not mounted in WR  [NHDS-8]
TP1  Test Point  [TEST_PAD_1mm]  (value not drawn)
TP2  Test Point  [TEST_PAD_1mm]  (value not drawn)

### Blocks framed on the sheet
Not mounted in White Rabbit: C62-C66 IC36 R50 R54 R56-R58

### Ports
ARM_DMARQ (out), ARM_FPGA_RESET (in), ARM_IRQ (out), ARM_NRST (out), ARM_PROGRAM_B (in), DMTD_CLK_N (in), DMTD_CLK_P (in), EXT_PROGRAM_B (in), FPGA_CCLK (in), FPGA_DIN (in), FPGA_DONE (out), FPGA_INIT_B (out), FPGA_JTAG (harness FPGA_JTAG), FPGA_MAIN_CLK_N (in), FPGA_MAIN_CLK_P (in), FPGA_WD (harness FPGA_WD), PPS_IN (in), PPS_OUT (out), QDRII_CLKS (harness QDRII_CLKS)

### Harnesses
QDRII_CLKS: QDRII_CLK_P, QDRII_CLK_N, QDRII_200CLK_P, QDRII_200CLK_N
FPGA_JTAG: FPGA_TMS, FPGA_TCK, FPGA_TDI, FPGA_TDO
FPGA_WD: FPGA_WD_SCL, FPGA_WD_SDA, FPGA_WD_INT, FPGA_WD_PROGRAM

### Nets
+1V8: C62.2 C63.2 IC36.A6(VCC1) IC36.H3(VCC0)
+2V5: C64.2 C65.2 C66.2 IC36.A4(VPP) IC36.C6(~{WP}) IC36.D5(VCCQ2) IC36.D6(VCCQ3) IC36.G4(VCCQ1) Q2.3(SOURCE) R44.2 R45.1 R46.2 R47.2 R48.2 R49.2 R51.1 R52.1 R53.1 R54.2 R55.2 R56.2 R57.2 R58.2
GND: C62.1 C63.1 C64.1 C65.1 C66.1 IC36.B2(VSS0) IC36.H2(VSS1) IC36.H4(VSS2) IC36.H6(VSS3) Q1.2(SOURCE) R43.1 R50.1 R177.1 R184.1 S3.5 S3.6 S3.7 S3.8
A0: IC33.AL8(IO_L13N_A00_D16_34) IC36.A1
A1: IC33.AK8(IO_L13P_A01_D17_34) IC36.B1(A2)
A2: IC33.AC9(IO_L12N_A02_D18_34) IC36.C1(A3)
A3: IC33.AD10(IO_L12P_A03_D19_34) IC36.D1(A4)
A4: IC33.C8(IO_L7N_A04_D20_34) IC36.D2(A5)
A5: IC33.B8(IO_L7P_A05_D21_34) IC36.A2(A6)
A6: IC33.E9(IO_L6N_A06_D22_34) IC36.C2(A7)
A7: IC33.E8(IO_L6P_A07_D23_34) IC36.A3(A8)
A8: IC33.A8(IO_L5N_A08_D24_34) IC36.B3(A9)
A9: IC33.A9(IO_L5P_A09_D25_34) IC36.C3(A10)
A10: IC33.D9(IO_L4N_VREF_A10_D26_34) IC36.D3(A11)
A11: IC33.C9(IO_L4P_A11_D27_34) IC36.C4(A12)
A12: IC33.D10(IO_L3N_A12_D28_34) IC36.A5(A13)
A13: IC33.C10(IO_L3P_A13_D29_34) IC36.B5(A14)
A14: IC33.F10(IO_L2N_A14_D30_34) IC36.C5(A15)
A15: IC33.F9(IO_L2P_A15_D31_34) IC36.D7(A16)
A16: IC33.AH8(IO_L18N_A16_34) IC36.D8(A17)
A17: IC33.AG8(IO_L18P_A17_34) IC36.A7(A18)
A18: IC33.AP9(IO_L17N_A18_34) IC36.B7(A19)
A19: IC33.AN9(IO_L17P_A19_34) IC36.C7(A20)
A20: IC33.AF10(IO_L16N_A20_34) IC36.C8(A21)
A21: IC33.AF9(IO_L16P_A21_34) IC36.A8(A22)
A22: IC33.AL9(IO_L15N_A22_34) IC36.G1(A23)
A23: IC33.AK9(IO_L15P_A23_34) IC36.H8(A24)
A24: IC33.AE9(IO_L14N_VREF_A24_34) IC36.B6(A25(N.C.))
ARM_DMARQ: IC33.AC22(IO_L19P_24) R52.2 ; port ARM_DMARQ
ARM_FPGA_RESET: IC33.M10(IO_L9N_MRCC_34) R184.2 ; port ARM_FPGA_RESET
ARM_IRQ: IC33.AC24(IO_L18N_24) R53.2 ; port ARM_IRQ
ARM_NRST: IC33.AD22(IO_L19N_24) R51.2 ; port ARM_NRST
ARM_PROGRAM_B: D10.2(K2) ; port ARM_PROGRAM_B
D0: IC33.AF24(IO_L13N_D0_FS0_24) IC36.F2(DQ0)
D1: IC33.AF25(IO_L13P_D1_FS1_24) IC36.E2(DQ1)
D2: IC33.W24(IO_L12N_D2_FS2_24) IC36.G3(DQ2)
D3: IC33.V24(IO_L12P_D3_24) IC36.E4(DQ3)
D4: IC33.H24(IO_L7N_D4_24) IC36.E5(DQ4)
D5: IC33.H25(IO_L7P_D5_24) IC36.G5(DQ5)
D6: IC33.P24(IO_L6N_D6_24) IC36.G6(DQ6)
D7: IC33.R24(IO_L6P_D7_24) IC36.H7(DQ7)
D8: IC33.G23(IO_L5N_D8_24) IC36.E1(DQ8)
D9: IC33.H23(IO_L5P_D9_24) IC36.E3(DQ9)
D10: IC33.N24(IO_L4N_VREF_D10_24) IC36.F3(DQ10)
D11: IC33.N23(IO_L4P_D11_24) IC36.F4(DQ11)
D12: IC33.F23(IO_L3N_D12_24) IC36.F5(DQ12)
D13: IC33.F24(IO_L3P_D13_24) IC36.H5(DQ13)
D14: IC33.L24(IO_L2N_D14_24) IC36.G7(DQ14)
D15: IC33.M23(IO_L2P_D15_24) IC36.E7(DQ15)
DIN: IC33.H8(DIN_0) R177.2 R179.1
DMTD_CLK_N: IC33.M22(IO_L0N_GC_24) ; port DMTD_CLK_N
DMTD_CLK_P: IC33.L23(IO_L0P_GC_24) ; port DMTD_CLK_P
DONE: IC33.R8(DONE_0) Q1.1(GATE) R46.1
EXT_PROGRAM_B: D9.1(K1) ; port EXT_PROGRAM_B
FPGA_CCLK: R158.1 ; port FPGA_CCLK
FPGA_DIN: R179.2 ; port FPGA_DIN
FPGA_DONE: Q1.3(DRAIN) ; port FPGA_DONE
FPGA_INIT_B: Q2.2(DRAIN) ; port FPGA_INIT_B
FPGA_MAIN_CLK_N: IC33.K23(IO_L1N_GC_24) ; port FPGA_MAIN_CLK_N  [project net FPGA_25MHZ_CLK_N]
FPGA_MAIN_CLK_P: IC33.K24(IO_L1P_GC_24) ; port FPGA_MAIN_CLK_P  [project net FPGA_25MHZ_CLK_P]
FPGA_TCK: IC33.AE8(TCK_0) ; port FPGA_JTAG.FPGA_TCK  [project net FPGA_JTAG.FPGA_TCK]
FPGA_TDI: IC33.AD8(TDI_0) ; port FPGA_JTAG.FPGA_TDI  [project net FPGA_JTAG.FPGA_TDI]
FPGA_TDO: IC33.AC8(TDO_0) ; port FPGA_JTAG.FPGA_TDO  [project net FPGA_JTAG.FPGA_TDO]
FPGA_TMS: IC33.AF8(TMS_0) ; port FPGA_JTAG.FPGA_TMS  [project net FPGA_JTAG.FPGA_TMS]
HSWAPEN: IC33.M8(HSWAPEN_0) S3.4
INIT_B: IC33.P8(INIT_B_0) Q2.1(GATE) R45.2
M0: IC33.U8(M0_0) R49.1 S3.3
M1: IC33.W8(M1_0) R48.1 S3.2
M2: IC33.V8(M2_0) R47.1 S3.1
PPS_OUT: IC33.U23(IO_L10P_MRCC_24) ; port PPS_OUT
PROGRAM_B: D9.3(A) D10.3(A) IC33.L8(PROGRAM_B_0) IC36.D4(~{RST}) R55.1
QDRII1_CAL_DONE: IC33.AP10(IO_L19N_VRP_34) TP1.1(TP)
QDRII2_CAL_DONE: IC33.AN10(IO_L19P_VRN_34) TP2.1(TP)
QDRII_200CLK_N: IC33.B10(IO_L1N_GC_34) ; port QDRII_CLKS.QDRII_200CLK_N
QDRII_200CLK_P: IC33.A10(IO_L1P_GC_34) ; port QDRII_CLKS.QDRII_200CLK_P
QDRII_CLK_N: IC33.H9(IO_L0N_GC_34) ; port QDRII_CLKS.QDRII_CLK_N
QDRII_CLK_P: IC33.J9(IO_L0P_GC_34) ; port QDRII_CLKS.QDRII_CLK_P
WD_INT: IC33.AC23(IO_L18P_24) ; port FPGA_WD.FPGA_WD_INT  [project net FPGA_WD.FPGA_WD_INT]
WD_PROGRAM_B: D9.2(K2) ; port FPGA_WD.FPGA_WD_PROGRAM  [project net FPGA_WD.FPGA_WD_PROGRAM]
WD_SCL: IC33.T24(IO_L8P_SRCC_24) ; port FPGA_WD.FPGA_WD_SCL  [project net FPGA_WD.FPGA_WD_SCL]
WD_SDA: IC33.T23(IO_L8N_SRCC_24) ; port FPGA_WD.FPGA_WD_SDA  [project net FPGA_WD.FPGA_WD_SDA]
NetIC33_AA24: IC33.AA24(IO_L14N_VREF_FOE_B_MOSI_24) IC36.F8(~{OE}) R56.1
NetIC33_AE23: IC33.AE23(IO_L17P_VRN_24) IC36.F7(WAIT)
NetIC33_AF23: IC33.AF23(IO_L15P_FWE_B_24) IC36.G8(~{WE}) R54.1
NetIC33_J25: IC33.J25(IO_L9P_MRCC_24) ; port PPS_IN
NetIC33_K8: IC33.K8(CCLK_0) R43.2 R44.1 R158.2
NetIC33_Y24: IC33.Y24(IO_L14P_FCS_B_24) IC36.B4(~{CE}) R57.1
NetIC36_E6: IC36.E6(CLK) R58.1
NetIC36_F6: IC36.F6(~{ADV}) R50.2

Not connected (* = marked no-connect by the designer): D10 1(K1)*; IC33 AA8(DOUT_BUSY_0) AA23(IO_L16P_RS0_24) AB10(IO_L10N_MRCC_34) AB23(IO_L16N_CSO_B_24) AC10(IO_L10P_MRCC_34) AD9(IO_L14P_A25_34) AD24(IO_L11P_SRCC_24) AE22(IO_L17N_VRP_24) AE24(IO_L11N_SRCC_24) AG23(IO_L15N_RS1_24) AH9(IO_L11P_SRCC_34) AJ9(IO_L11N_SRCC_34) F8(CSI_B_0)* G8(RDWR_B_0)* J24(IO_L9N_MRCC_24) K9(IO_L8N_SRCC_34) L9(IO_L8P_SRCC_34) L10(IO_L9P_MRCC_34) V23(IO_L10N_MRCC_24) W17(DXN_0) W18(DXP_0); IC36 B8(RFU4)* E8(RFU5)* F1(RFU1)* G2(RFU3)* H1(RFU2)*

### Layout directives
differential pair: DMTD_CLK_N, DMTD_CLK_P, FPGA_25MHZ_CLK_N, FPGA_25MHZ_CLK_P, QDRII_200CLK_N, QDRII_200CLK_P, QDRII_CLK_N, QDRII_CLK_P

### Notes on the sheet
- M[2:0] = 111
  Slave Serial Configuration Mode selected by defect.
  HSWAPEN = 1 (internal pull-up)
  3-state I/Os during configuration
- (in symbol XC6VLX130T-1FF1156C, part H) BANK 24
- (in symbol XC6VLX130T-1FF1156C, part M) BANK 34

### Library data of the parts
C62 C63 C65 C66 = CC0402_100NF_16V_10%_X7R: as C100 on sheet FPGA_GTX; Published: 8-Jun-2000; LatestRevisionDate: 17-Jul-2002; LatestRevisionNote: Re-released for DXP Platform.; PackageReference: RAD-0.3; Publisher: Altium Limited; Distributor1: Digikey; Distributor1 PN: 445-4952-1-ND; Case: 0402; Value: 100nF
C64 = CC0603_10UF_6.3V_20%_X5R: Capacitor; Manufacturer1: TDK; Manufacturer1 PN: C1608X5R0J106M; TC: X5R; Tolerance: ±20%; Voltage: 6.3V; Published: 8-Jun-2000; LatestRevisionDate: 17-Jul-2002; LatestRevisionNote: Re-released for DXP Platform.; PackageReference: RAD-0.3; Publisher: Altium Limited; Distributor1: Digikey; Distributor1 PN: 445-4112-1-ND; Case: 0603; Value: 10uF
D9 D10 = BAT54A.1: Schottky Barrier Double Diode; PACKAGE_INFORMATION: Latest Revision: May-1999; DEVICE: BAT54A-G; PKG_TYPE: SOT23; PUBLISHED: 17-Sep-2003; DATASHEET: Latest Revision: 4-Mar-2002; PACKAGE_REFERENCE: SOT23; PUBLISHER: Altium Limited; Value: BAT54A-G; Distributor1 PN: 641-1319-1-ND; Distributor1: Digikey
IC33 = XC6VLX130T-1FF1156C: as IC33 on sheet SMI_Link_7-12; FirstPublished: 17-Nov-2009; DatasheetVersion: v2.0, Sep-2009; PackageVersion: ver1.0, Jun-2009; PackageReference: FF1156; Publisher: Altium Limited; PackageDescription: 1156-Ball Flip-Chip Fine Pitch Ball Grid Array (FF1156); Code_JEDEC: MS-034-AAR-1; Code_IPC: BGA100P34X34-1156; ComponentLink1Description: Virtex-6 Datasheet; ComponentLink1URL: http://www.xilinx.com/support/documentation/data_sheets/ds150.pdf; ComponentLink2Description: Pinout Specification; ComponentLink2URL: http://www.xilinx.com/support/packagefiles/virtex-6-pkgs.htm; ComponentLink3Description: FF1156 Package Drawing; ComponentLink3URL: http://www.xilinx.com/support/documentation/package_specs/ff1156.pdf; ComponentLink4Description: Virtex-6 Documents; ComponentLink4URL: http://www.xilinx.com/support/documentation/virtex-6.htm; ComponentLink5Description: Xilinx.com Home; ComponentLink5URL: http://www.xilinx.com
IC36 = PC28F256P30BFA: NOR Flash Memory, 256Mbit; Value: PC28F256P30BFA; Distributor1 PN: PC28F256P30BFA-ND; Distributor1: Digikey; Case: TBGA-64
Q1 = NDS331N: N-Channel Logic Level Enhancement Mode Field Effect Transistor; DEVICE: NDS331N; VALUE: NDS331N; Distributor1 PN: NDS331NCT-ND; Distributor1: Digikey
Q2 = BSS84-7-F: P-Channel Logic Level Enhancement Mode Field Effect Transistor; MANF: Diodes Inc.; PKG_TYPE: SOT-23; DEVICE: FET-3PIN; Value: BSS84-7-F; Distributor1 PN: BSS84-FDICT-ND; Distributor1: Digikey; MANF_P/N: BSS84-7-F
R43 R44 = R0402_100R_±1%_0.1W_100PPM: SMD Resistor; Manufacturer1: Panasonic; Manufacturer1 PN: ERJ-2RKF1000X; TCR: 100ppm; Power Rating: 0.1W; Tolerance: ±1%; Case: 0402; Distributor1: DigiKey; Distributor1 PN: P100LCT-ND; Value: 100R
R45 R47-R50 R54-R58 = R0402_4.7K_±1%_0.1W_100PPM: as R12 on sheet External WatchDogs; Case: 0402; Distributor1: DigiKey; Distributor1 PN: ERJ-2RKF4701X; Value: 4K7
R46 = R0402_330R_±1%_0.1W_100PPM: SMD Resistor; Manufacturer1: Panasonic; Manufacturer1 PN: ERJ-2RKF3300X; TCR: 100ppm; Power Rating: 0.1W; Tolerance: ±1%; Case: 0402; Distributor1: DigiKey; Distributor1 PN: P330LCT-ND; Value: 330R
R51-R53 = R0402_O.C.: SMD Resistor; Case: 0402; Manufacturer1: N/A; Manufacturer1 PN: N/A; Distributor1: N/A; Distributor1 PN: N/A; TCR: N/A; Power Rating: N/A; Tolerance: N/A; Value: o.c.
R158 R179 = R0402_0R_0.1W_JUMPER: SMD Resistor; Manufacturer1: Panasonic; Manufacturer1 PN: ERJ-2GE0R00X; TCR: 100ppm; Power Rating: 0.1W; Case: 0402; Distributor1: DigiKey; Distributor1 PN: P0.0JCT-ND; Tolerance: Jumper
R177 = R0402_300R_±1%_0.1W_100PPM: SMD Resistor; Manufacturer1: Panasonic; Manufacturer1 PN: ERJ-2RKF3000X; TCR: 100ppm; Power Rating: 0.1W; Tolerance: ±1%; Case: 0402; Distributor1: DigiKey; Distributor1 PN: P300LCT-ND; Value: 300R
R184 = R0402_200R_±1%_0.1W_100PPM: SMD Resistor; Manufacturer1: Panasonic; Manufacturer1 PN: ERJ-2RKF2000X; TCR: 100ppm; Power Rating: 0.1W; Tolerance: ±1%; Case: 0402; Distributor1: DigiKey; Distributor1 PN: P200LCT-ND; Value: 200R
S3 = SW-DIP4: 4 Positions DIP SWITCH; Manufacturer: CTS Electrocomponents; Value: 219-4MST; Distributor1 PN: CT2194MST-ND; Distributor1: Digikey
TP1 TP2 = TEST_POINT: SMD 1mm Test Point

## Sheet CPU_IO_Ports.SchDoc
size A4
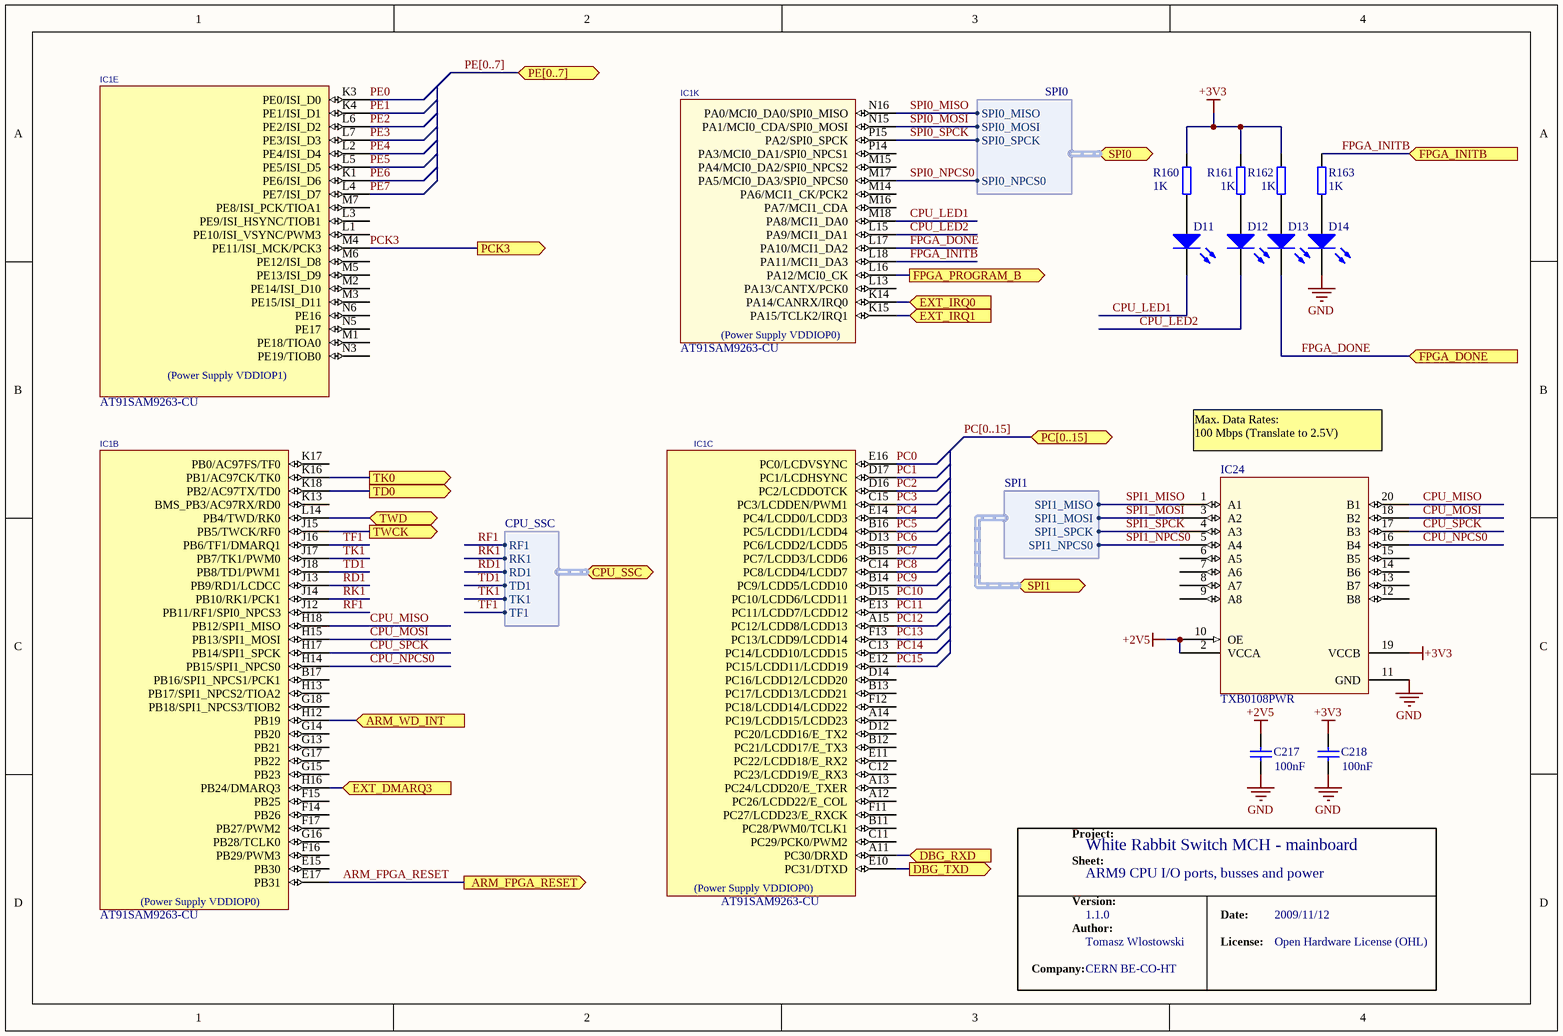
[diagram p13: CPU_IO_Ports.SchDoc]

### Parts
(Parts that share a designator on the sheet are numbered #1, #2 ... from top to bottom, then left to right.)
C217  100nF  [CC1005-0402]
C218  100nF  [CC1005-0402]
D11  LED  [CD1608-0603]  (value not drawn)
D12  LED  [CD1608-0603]  (value not drawn)
D13  LED  [CD1608-0603]  (value not drawn)
D14  LED  [CD1608-0603]  (value not drawn)
IC1#1  AT91SAM9263-CU  [TFBGA324]  (parts B,C,E,K of 12)
IC24  TXB0108PWR  [TSSOP20]
R160  1K  [0402]
R161  1K  [0402]
R162  1K  [0402]
R163  1K  [0402]

### Ports
ARM_FPGA_RESET (out), ARM_WD_INT (in), CPU_SSC (harness CPU_SSC), DBG_RXD (in), DBG_TXD (out), EXT_DMARQ3 (in), EXT_IRQ0 (in), EXT_IRQ1 (in), FPGA_DONE (in), FPGA_INITB (in), FPGA_PROGRAM_B (out), PC[0..15] (bidir), PCK3 (out), PE[0..7] (bidir), SPI0 (harness SPI0), SPI1 (harness SPI1), TD0 (out), TK0 (out), TWCK (out), TWD (bidir)

### Harnesses
CPU_SSC: TF1, TK1, TD1, RD1, RK1, RF1
SPI0: SPI0_MISO, SPI0_MOSI, SPI0_SPCK, SPI0_NPCS0
SPI1: SPI1_MISO, SPI1_MOSI, SPI1_SPCK, SPI1_NPCS0

### Nets
+2V5: C217.2 IC24.2(VCCA) IC24.10(OE)
+3V3: C218.2 IC24.19(VCCB) R160.1 R161.1 R162.1
GND: C217.1 C218.1 D14.2(K) IC24.11(GND)
ARM_DMARQ: IC1#1.H16(PB24/DMARQ3) ; port EXT_DMARQ3
ARM_FPGA_RESET: IC1#1.E17(PB31) ; port ARM_FPGA_RESET
ARM_IRQ: IC1#1.K15(PA15/TCLK2/IRQ1) ; port EXT_IRQ1
ARM_PROGRAM_B: IC1#1.L16(PA12/MCI0_CK) ; port FPGA_PROGRAM_B
CPU_LED1: D11.2(K) IC1#1.M18(PA8/MCI1_DA0)
CPU_LED2: D12.2(K) IC1#1.L15(PA9/MCI1_DA1)
CPU_MISO: IC1#1.H18(PB12/SPI1_MISO) IC24.20(B1)
CPU_MOSI: IC1#1.H15(PB13/SPI1_MOSI) IC24.18(B2)
CPU_NPCS0: IC1#1.H14(PB15/SPI1_NPCS0) IC24.16(B4)
CPU_SPCK: IC1#1.H17(PB14/SPI1_SPCK) IC24.17(B3)
FPGA_CCLK: IC1#1.K16(PB1/AC97CK/TK0) ; port TK0
FPGA_DIN: IC1#1.K18(PB2/AC97TX/TD0) ; port TD0
FPGA_DONE: D13.2(K) IC1#1.L17(PA10/MCI1_DA2) ; port FPGA_DONE
FPGA_INITB: IC1#1.L18(PA11/MCI1_DA3) R163.1 ; port FPGA_INITB  [project net FPGA_INIT_B]
PC0: IC1#1.E16(PC0/LCDVSYNC)
PC1: IC1#1.D17(PC1/LCDHSYNC)
PC2: IC1#1.D16(PC2/LCDDOTCK)
PC3: IC1#1.C15(PC3/LCDDEN/PWM1)
PC4: IC1#1.E14(PC4/LCDD0/LCDD3)
PC5: IC1#1.B16(PC5/LCDD1/LCDD4)
PC6: IC1#1.D13(PC6/LCDD2/LCDD5)
PC7: IC1#1.B15(PC7/LCDD3/LCDD6)
PC8: IC1#1.C14(PC8/LCDD4/LCDD7)
PC9: IC1#1.B14(PC9/LCDD5/LCDD10)
PC10: IC1#1.D15(PC10/LCDD6/LCDD11)
PC11: IC1#1.E13(PC11/LCDD7/LCDD12)
PC12: IC1#1.A15(PC12/LCDD8/LCDD13)
PC13: IC1#1.F13(PC13/LCDD9/LCDD14)
PC14: IC1#1.C13(PC14/LCDD10/LCDD15)
PC15: IC1#1.E12(PC15/LCDD11/LCDD19)
PCK3: IC1#1.M4(PE11/ISI_MCK/PCK3) ; port PCK3
PE0: IC1#1.K3(PE0/ISI_D0)
PE1: IC1#1.K4(PE1/ISI_D1)
PE2: IC1#1.L6(PE2/ISI_D2)
PE3: IC1#1.L7(PE3/ISI_D3)
PE4: IC1#1.L2(PE4/ISI_D4)
PE5: IC1#1.L5(PE5/ISI_D5)
PE6: IC1#1.K1(PE6/ISI_D6)
PE7: IC1#1.L4(PE7/ISI_D7)
RD1: IC1#1.J13(PB9/RD1/LCDCC) ; port CPU_SSC.RD1  [project net CPU_SSC.RD1]
RF1: IC1#1.J12(PB11/RF1/SPI0_NPCS3) ; port CPU_SSC.RF1  [project net CPU_SSC.RF1]
RK1: IC1#1.J14(PB10/RK1/PCK1) ; port CPU_SSC.RK1  [project net CPU_SSC.RK1]
SPI0_MISO: IC1#1.N16(PA0/MCI0_DA0/SPI0_MISO) ; port SPI0.SPI0_MISO  [project net SPI0.SPI0_MISO]
SPI0_MOSI: IC1#1.N15(PA1/MCI0_CDA/SPI0_MOSI) ; port SPI0.SPI0_MOSI  [project net SPI0.SPI0_MOSI]
SPI0_NPCS0: IC1#1.M17(PA5/MCI0_DA3/SPI0_NPCS0) ; port SPI0.SPI0_NPCS0  [project net SPI0.SPI0_NPCS0]
SPI0_SPCK: IC1#1.P15(PA2/SPI0_SPCK) ; port SPI0.SPI0_SPCK  [project net SPI0.SPI0_SPCK]
SPI1_MISO: IC24.1(A1) ; port SPI1.SPI1_MISO  [project net SPI1.SPI1_MISO]
SPI1_MOSI: IC24.3(A2) ; port SPI1.SPI1_MOSI  [project net SPI1.SPI1_MOSI]
SPI1_NPCS0: IC24.5(A4) ; port SPI1.SPI1_NPCS0  [project net SPI1.SPI1_NPCS0]
SPI1_SPCK: IC24.4(A3) ; port SPI1.SPI1_SPCK  [project net SPI1.SPI1_SPCK]
TD1: IC1#1.J18(PB8/TD1/PWM1) ; port CPU_SSC.TD1  [project net CPU_SSC.TD1]
TF1: IC1#1.J16(PB6/TF1/DMARQ1) ; port CPU_SSC.TF1  [project net CPU_SSC.TF1]
TK1: IC1#1.J17(PB7/TK1/PWM0) ; port CPU_SSC.TK1  [project net CPU_SSC.TK1]
NetD11_1: D11.1(A) R160.2
NetD12_1: D12.1(A) R161.2
NetD13_1: D13.1(A) R162.2
NetD14_1: D14.1(A) R163.2
NetIC1#1_A11: IC1#1.A11(PC30/DRXD) ; port DBG_RXD
NetIC1#1_E10: IC1#1.E10(PC31/DTXD) ; port DBG_TXD
NetIC1#1_H12: IC1#1.H12(PB19) ; port ARM_WD_INT
NetIC1#1_J15: IC1#1.J15(PB5/TWCK/RF0) ; port TWCK
NetIC1#1_K14: IC1#1.K14(PA14/CANRX/IRQ0) ; port EXT_IRQ0
NetIC1#1_L14: IC1#1.L14(PB4/TWD/RK0) ; port TWD

Not connected (* = marked no-connect by the designer): IC1#1 A12(PC26/LCDD22/E_COL) A13(PC24/LCDD20/E_TXER) A14(PC19/LCDD15/LCDD23) B11(PC28/PWM0/TCLK1) B12(PC21/LCDD17/E_TX3) B13(PC17/LCDD13/LCDD21) B17(PB16/SPI1_NPCS1/PCK1) C11(PC29/PCK0/PWM2) C12(PC23/LCDD19/E_RX3) D12(PC20/LCDD16/E_TX2) D14(PC16/LCDD12/LCDD20) E11(PC22/LCDD18/E_RX2) E15(PB30) F11(PC27/LCDD23/E_RXCK) F12(PC18/LCDD14/LCDD22) F14(PB26) F15(PB25) F16(PB29/PWM3) F17(PB27/PWM2) G13(PB21) G14(PB20) G15(PB23) G16(PB28/TCLK0) G17(PB22) G18(PB18/SPI1_NPCS3/TIOB2) H13(PB17/SPI1_NPCS2/TIOA2) K13(BMS_PB3/AC97RX/RD0) K17(PB0/AC97FS/TF0) L1(PE10/ISI_VSYNC/PWM3) L3(PE9/ISI_HSYNC/TIOB1) L13(PA13/CANTX/PCK0) M1(PE18/TIOA0) M2(PE14/ISI_D10) M3(PE15/ISI_D11) M5(PE13/ISI_D9) M6(PE12/ISI_D8) M7(PE8/ISI_PCK/TIOA1) M14(PA6/MCI1_CK/PCK2) M15(PA4/MCI0_DA2/SPI0_NPCS2) M16(PA7/MCI1_CDA) N3(PE19/TIOB0) N5(PE17) N6(PE16) P14(PA3/MCI0_DA1/SPI0_NPCS1); IC24 6(A5) 7(A6) 8(A7) 9(A8) 12(B8) 13(B7) 14(B6) 15(B5)

### Buses and harness runs
bus PC[0..15] = port PC[0..15]
bus PE[0..7] = port PE[0..7]

### Notes on the sheet
- Max. Data Rates:
  100 Mbps (Translate to 2.5V)
- Project:
- White Rabbit Switch MCH - mainboard
- Sheet:
- Version:
- ARM9 CPU I/O ports, busses and power
- 1.1.0
- Date:
- 2009/11/12
- Company:
- Author:
- Tomasz Wlostowski
- CERN BE-CO-HT
- License:
- Open Hardware License (OHL)
- (in symbol AT91SAM9263, part B) (Power Supply VDDIOP0)
- (in symbol AT91SAM9263, part C) (Power Supply VDDIOP0)
- (in symbol AT91SAM9263, part E) (Power Supply VDDIOP1)
- (in symbol AT91SAM9263, part K) (Power Supply VDDIOP0)

### Library data of the parts
C217 C218 = CC0402_100NF_16V_10%_X7R: Capacitor; Manufacturer1: TDK; Manufacturer1 PN: C1005X7R1C104K; TC: X7R; Tolerance: ±10%; Voltage: 16V; Published: 8-Jun-2000; LatestRevisionDate: 17-Jul-2002; LatestRevisionNote: Re-released for DXP Platform.; PackageReference: RAD-0.3; Publisher: Altium Limited; Distributor1: Digikey; Distributor1 PN: 445-4952-1-ND; Case: 0402; Value: 100nF
D11-D14 = LED0: Typical INFRARED GaAs LED; Value: LG L29K-G2J1-24-Z; Published: 8-Jun-2000; LatestRevisionDate: 08-Jul-2005; LatestRevisionNote: Mech Layer 1 removed.; PackageReference: LED-0; Publisher: Altium Limited; Distributor1: Digikey; Distributor1 PN: 475-2709-1-ND
IC1#1 = AT91SAM9263: Atmel ARM926 MCU; Supplier: EBV; RefId: AT91SAM9263-CU; Value: AT91SAM9263-CU
IC24 = TXB0108: 8-Bit Bidirectional Voltage-Level Translator with Auto-Direction Sensing; Value: TXB0108PWR; Distributor1: Digikey; Distributor1 PN: 296-21527-1-ND
R160-R163 = R0402_1K_±1%_0.1W_100PPM: SMD Resistor; Manufacturer1: Panasonic; Manufacturer1 PN: ERJ-2RKF1001X; TCR: 100ppm; Power Rating: 0.1W; Tolerance: ±1%; Case: 0402; Distributor1: DigiKey; Distributor1 PN: P1.00KLCT-ND; Value: 1K